# EAGLE design strobeAT10 (EAGLE 9.3.1)
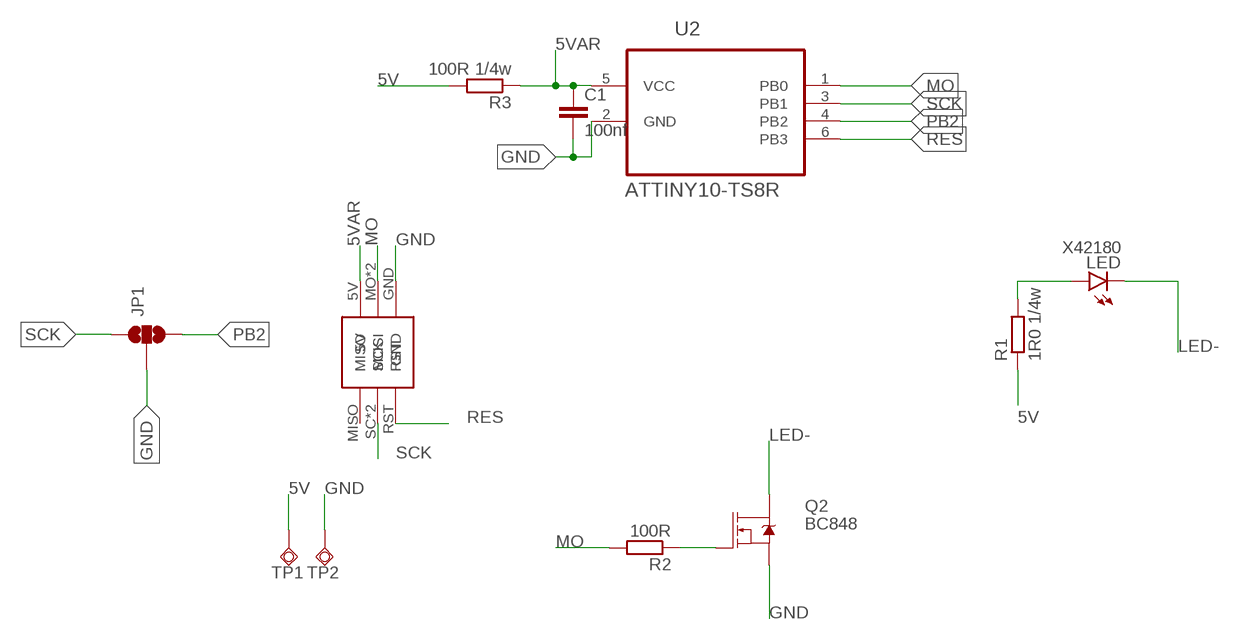
[diagram p0: schematic, sheet 1]

## Parts
C1  100nf  C-EUC0603  [C0603]
JP1  JUMPER-SMT_3_NO_SILK  [SMT-JUMPER_3_NO_SILK]
LED  X42180  [Z-POWER-LED-DOME-TYPE]
Q2  BC848  MOSFET-NCH-AO3404A  [SOT23-3]
R1  1R0 1/4w  R-EU_R0805  [R0805]
R2  100R  R-EU_R0603  [R0603]
R3  100R 1/4w  R-EU_R0805  [R0805]
TP1  TPSQPAD1-13Y  [P1-13Y]
TP2  TPSQPAD1-13Y  [P1-13Y]
U2  ATTINY10-TS8R  [SOT95P280X145-6N]
U$1  ISCP_PORTPOGONEW  [ISCP_PADS_2ROW2HNEW]

## Nets
5V: R1.1 R3.2 TP1.TP
5VAR: C1.1 R3.1 U2.5(VCC) U$1.5V
GND: C1.2 JP1.2 Q2.2(S) TP2.TP U2.2(GND) U$1.GND
LED-: LED.C Q2.3(D)
MO: R2.2 U2.1(PB0) U$1.MO(MOSI) U$1.MOSI
N$1: LED.A R1.2
N$3: Q2.1(G) R2.1
PB2: JP1.3 U2.4(PB2)
RES: U2.6(PB3) U$1.RST
SCK: JP1.1 U2.3(PB1) U$1.SC(SCK) U$1.SCK
Unconnected: U$1.MISO

## Library data of the parts
C1 = rcl:C-EU: CAPACITOR, European symbol; SPICEPREFIX: C
JP1 = SparkFun-Jumpers:JUMPER-SMT_3_NO: Normally open jumper This jumper has three pads in close proximity to each other. Apply solder to close the connection(s).
LED = led:X42180: Z-Power LED P4 Series, Dome type Source: http://www.seoulsemicon.co.kr .. X42180.pdf
Q2 = SparkFun-DiscreteSemi:MOSFET-NCH: N-channel MOSFETs Voltage controlled devices that allow control of high current outputs. SparkFun Products: SparkFun OpenScale <https://www.sparkfun.com/products/13261> SparkFun Digital Sandbox <https://www.sparkfun.com/products/12651> SparkFun Monster Moto Shield <https://www.sparkfun.com/products/10182> SparkFun MOSFET Power Controller <https://www.sparkfun.com/products/11214>; PROD_ID: TRANS-12988; VALUE: 5.8A/30V/35mΩ
R1-R3 = resistor:R-EU_: RESISTOR, European symbol
TP1 TP2 = testpad:TPSQ: Test pad
U2 = ATTINY10-TS8R:ATTINY10-TS8R: 8-bit Microcontroller with In-System Programmable Flash; AVAILABILITY: Unavailable; DESCRIPTION: Embedded microcontroller ATTINY10-TS8R SOT 23 Microchip Technology 8-Bit 10 MHz I/O number 4; MF: Microchip; MP: ATTINY10-TS8R; PACKAGE: SOT-23-6 Microchip; PRICE: None
U$1 = CoreDuino:ISCP_PORT

## Net classes
0 default: width 0.2 mm, clearance 0.2 mm

## Board
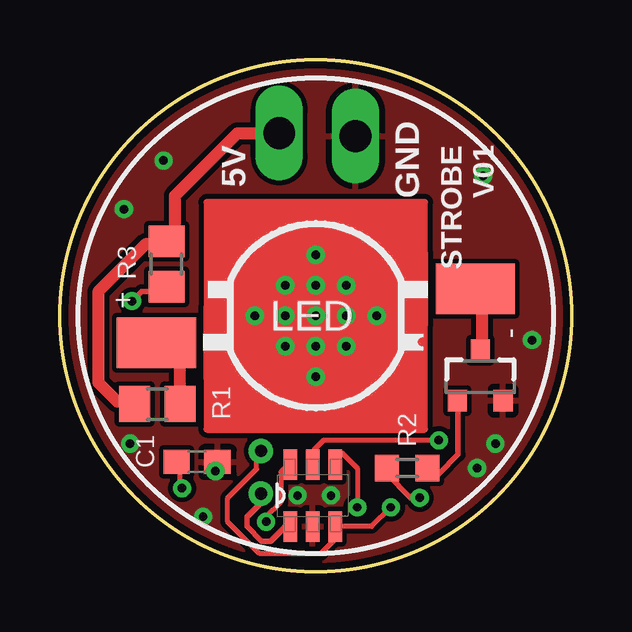
[diagram p1: board, top side]
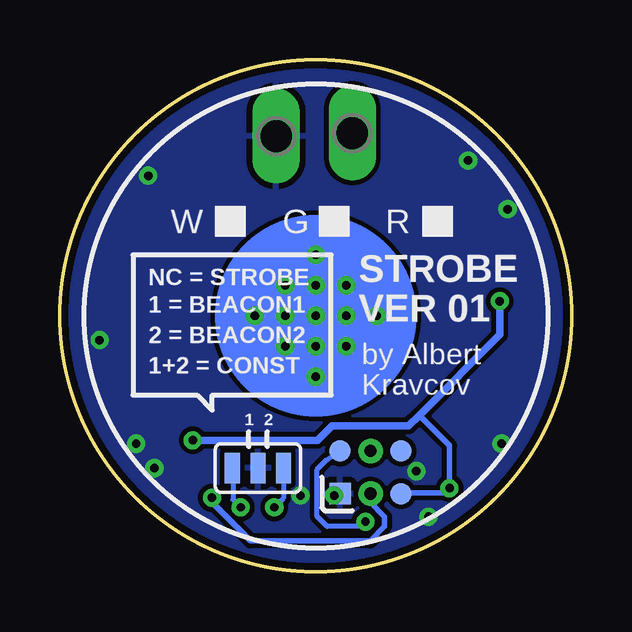
[diagram p2: board, bottom side, seen from below]

Size 21.34 x 21.34 mm. Coordinates in mm from the lower left corner, seen from the top.
Outline: circle at 10.67,10.67 radius 10.67
Copper layers (1*16): Top 0.035mm / dielectric 1.5mm / Bottom 0.035mm
Design rules "default *": minimum track width 6mil, minimum drill 0.35mm, track to track 6mil, track to pad 6mil, pad to pad 6mil, via to via 6mil, smd to smd 6mil, copper to edge 0.3mm, drill to drill 6mil, minimum pad ring 10mil, minimum via ring 8mil, stop-mask expansion 4mil, vias tented up to drill 1mm, thermal gap 10mil

### Footprints (pad centres in the part's own frame; a part is rotated, then mirrored left to right if it is on the bottom)
C0603 = smd 1.1 x 1: 1 -0.85,0; 2 0.85,0
SMT-JUMPER_3_NO_SILK = smd 0.635 x 1.27: 1 -1.067,0; 2 0,0; 3 1.067,0
Z-POWER-LED-DOME-TYPE = smd 3.3 x 2.1: A -6.65,-1.12; C 6.65,1.12
SOT23-3 = smd 0.8 x 0.9: 1 -0.95,-1; 2 0.95,-1; 3 0,1.1
R0805 = smd 1.3 x 1.5: 1 -0.95,0; 2 0.95,0
R0603 = smd 1 x 1.1: 1 -0.85,0; 2 0.85,0
P1-13Y = drill 1.321 pad 1.905 long: TP 0,0
SOT95P280X145-6N = smd 1.27 x 0.559: 1 -1.295,0.94; 2 -1.295,0; 3 -1.295,-0.94; 4 1.295,-0.94; 5 1.295,0; 6 1.295,0.94
ISCP_PADS_2ROW2HNEW = smd 0.889 x 0.889: 5V -1.27,1.778; GND 1.27,1.778; MISO -1.27,0; MOSI 0,1.778; RST 1.27,0; SCK 0,0 | drill 0.508 pad 0.889: MO 0,1.778; SC 0,0

### Placement (x,y rotation side)
C1  5.72,4.57 0 top
JP1  13.08,4.32 0 bottom
LED  10.67,10.67 0 top
Q2  17.53,8.13 0 top
R1  4.06,6.98 0 top
R2  14.48,4.32 180 top
R3  4.45,12.83 90 top
TP1  9.14,18.29 0 bottom
TP2  12.32,18.16 0 bottom
U2  10.54,3.17 90 top
U$1  8.38,5.03 180 bottom

### Tracks (layer width: path | path; a pad name or v marks a point on that pad's centre or on a via)
5V
  Top 0.2: 2.4,7.08 3,7.08 R1.1 | 3.6,13.68 4.4,13.68 R3.2 4.6,13.88 4.8,14.08
  Top 0.508: 2.4,7.08 1.6,7.88 1.6,11.68 3.6,13.68 | 4.8,14.08 4.8,15.68 7.4,18.28 9.01,18.28 TP1.TP
5VAR  (via drill 0.35)
  Top 0.2: 5,3.57 5,4.47 C1.1 | v15.8,5.48 11,5.48 10.6,5.08 10.6,4.48 U2.5 | 4.4,11.68 R3.1
  Top 0.229: 5,3.57 v5.09,3.48 | 4.4,11.68 3.4,11.68 v3,11.28
  Bottom 0.2: 7.1,3.28 U$1.5V
  Bottom 0.229: 7.1,3.28 5.29,3.28 v5.09,3.48 5.09,5.26 6.35,6.52
  Bottom 0.305: v15.8,5.48 10.6,5.48 10,6.08 6.8,6.08 6.35,6.52 3,9.88 v3,11.28
COOL  (via drill 0.35)
  Top 0.2: v8.13,10.67 v9.4,10.67 | v9.4,10.67 v9.4,11.94 v10.67,11.94 | v10.67,11.94 v10.67,10.67 v10.67,9.4 | v10.67,9.4 v10.67,8.13 | v9.4,10.67 v9.4,9.4 v10.67,9.4 | v10.67,9.4 v11.94,9.4 v11.94,10.67 | v11.94,10.67 v11.94,11.94 v10.67,11.94 | v10.67,11.94 v10.67,13.21 | v11.94,10.67 v13.21,10.67
  pour Bottom: 5.59,15.75 15.75,15.75 15.75,5.59 5.59,5.59
GND  (via drill 0.35)
  other vias: 2.92,5.33 5.97,2.29 9.91,3.17 18.16,5.33 17.4,4.32 6.48,4.19 19.69,9.65 17.65,16.51 4.32,17.14 2.67,15.11 11.3,3.17
  pour Top: -3.3,23.37 24.64,23.37 24.64,-0.76 22.1,-3.3 -3.3,-3.3
  pour Bottom: -7.11,24.64 25.91,24.64 25.91,-4.57 24.64,-5.84 -7.11,-5.84
LED-
  Top 0.2: 17.6,11.48 17.4,11.68 LED.C | 17.6,9.28 Q2.3
  Top 0.508: 17.6,11.48 17.6,9.28
MO  (via drill 0.35)
  Top 0.2: 9.4,1.88 U2.1 | 8.4,3.33 U$1.MOSI | R2.2 13.63,4.07
  Top 0.229: 9.4,1.88 8.79,1.27 8.41,1.27 7.8,1.88 7.8,2.28 8.4,2.88 8.4,3.33 | v15,3.08 14.62,3.08 13.63,4.07
  Bottom 0.2: 14.98,3.06 v15,3.08 | 8.4,3.33 8.4,2.88 U$1.MOSI 8.4,3.33
  Bottom 0.229: 14.98,3.06 14.98,2.86 13.4,1.28 8.4,1.28 7.8,1.88 7.8,2.28 8.4,2.88
N$1
  Top 0.2: 5,8.68 4.2,9.48 LED.A | 5,7.08 R1.2
  Top 0.508: 5,8.68 5,7.08
N$3
  Top 0.2: 15.8,4.08 15.6,4.08 15.4,4.28 R2.1 | 16.6,7.08 Q2.1
  Top 0.229: 16.6,7.08 16.6,4.88 15.8,4.08
PB2  (via drill 0.35)
  Top 0.2: v12.4,2.68 12.4,4.31 11.73,4.98 11.48,4.72 U2.4
  Bottom 0.2: v12.4,2.68 12.02,3.06 JP1.3
RES  (via drill 0.35)
  Top 0.2: v8.6,2.08 8.6,2.28 9.22,2.9 9.22,4.15 9.54,4.47 U2.6
  Bottom 0.2: v8.6,2.08 8.8,1.88 10.2,1.88 10.62,2.3 10.62,4.26 10.2,4.68 10.18,4.68 U$1.RST
SCK  (via drill 0.35)
  Top 0.2: v13.8,2.68 13,1.88 11.6,1.88 U2.3 11.4,1.88 11.4,1.28 10.87,0.75 8.33,0.75 7,2.08 7,3.08 8.2,4.28 8.2,4.93 U$1.SCK
  Bottom 0.2: v13.8,2.68 14.13,3 14.13,3.88 14.15,3.9 JP1.1
(copper drawn outside any net)
  shapes: Bottom circle x1

### Text on the board
tNames: GND | 5V | STROBE / V01 | + | -
bNames: R | G | W | STROBE | NC = STROBE | VER 01 | 1 = BEACON1 | 2 = BEACON2 | by Albert | 1+2 = CONST | Kravcov | 2 | 1